# Altium project PWR_MNG.PRJPCB
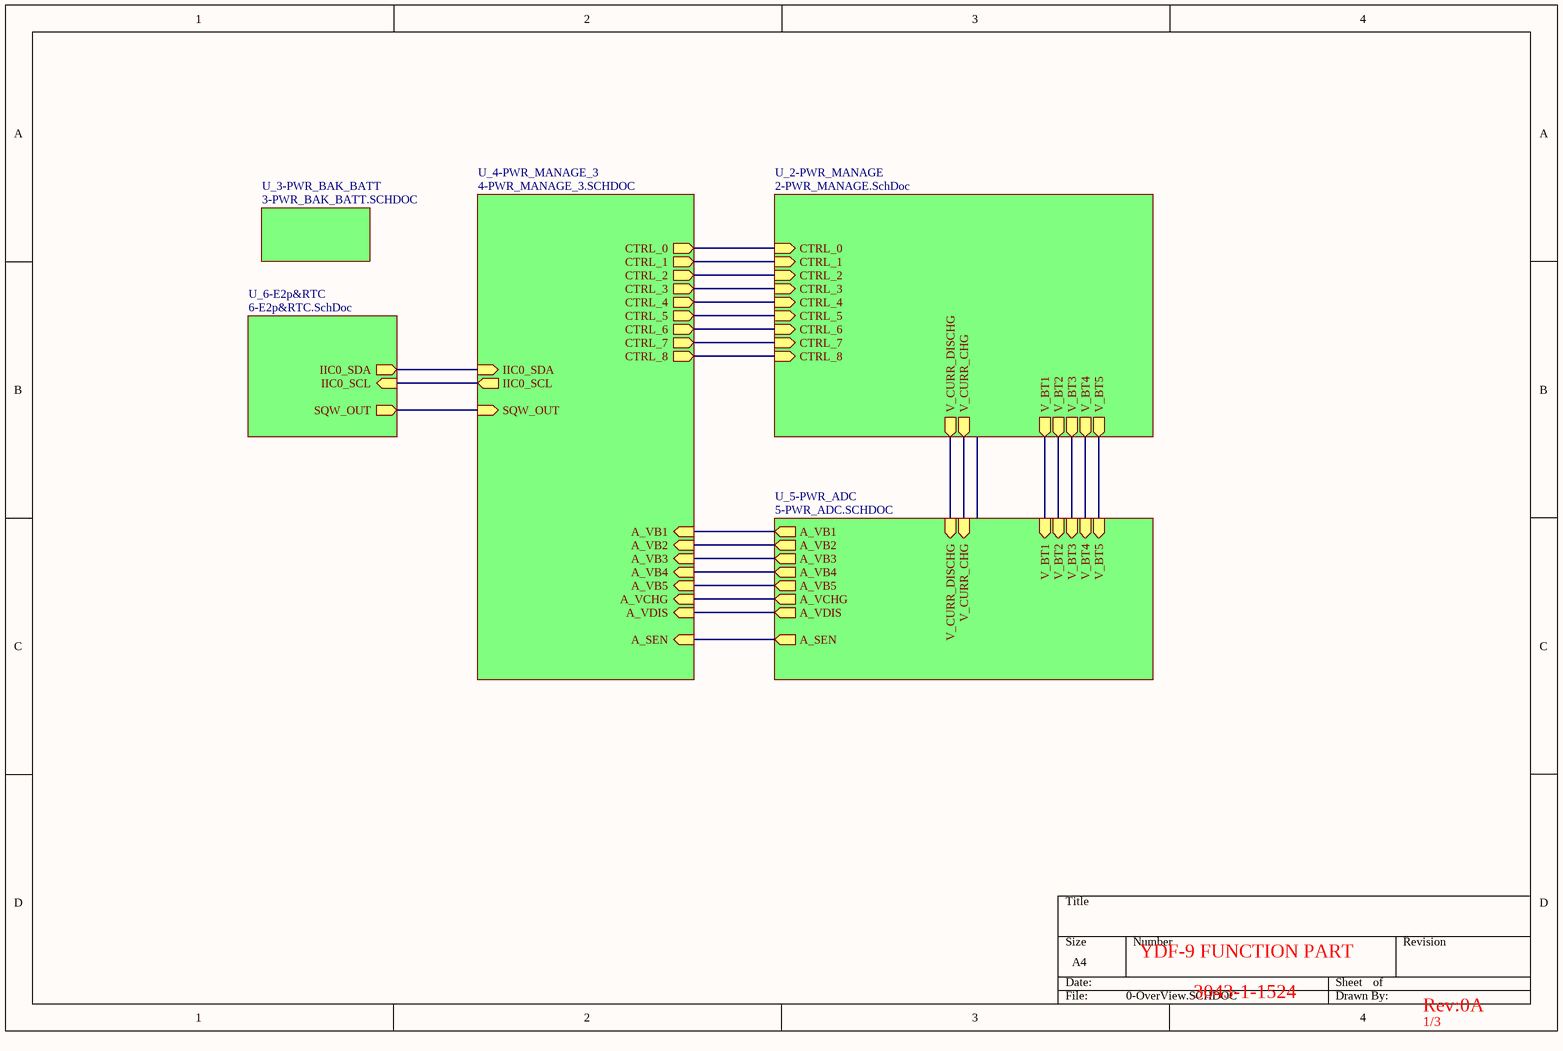
[diagram p0: 0-OverView.SCHDOC]
.TITLE: aaaaa
6 sheets, 178 parts. Net scope: hierarchical (ports join the sheet entries above them; power ports are global).
Board file: 3043-1-1532.PcbDoc
Sheets:
  0-OverView.SCHDOC
    U_2-PWR_MANAGE = 2-PWR_MANAGE.SchDoc
    U_3-PWR_BAK_BATT = 3-PWR_BAK_BATT.SCHDOC
    U_4-PWR_MANAGE_3 = 4-PWR_MANAGE_3.SCHDOC
    U_5-PWR_ADC = 5-PWR_ADC.SCHDOC
    U_6-E2p&RTC = 6-E2p&RTC.SchDoc

## Sheet 0-OverView.SCHDOC
size A4

### Sub-sheets
U_2-PWR_MANAGE = 2-PWR_MANAGE.SchDoc: V_BT1 (out), V_BT2 (out), V_BT3 (out), V_BT4 (out), V_BT5 (out), V_CURR_CHG (out), V_CURR_DISCHG (out), CTRL_8 (in), CTRL_0 (in), CTRL_2 (in), CTRL_7 (in), CTRL_1 (in), CTRL_4 (in), CTRL_3 (in), CTRL_5 (in), CTRL_6 (in)
U_3-PWR_BAK_BATT = 3-PWR_BAK_BATT.SCHDOC: no entries
U_4-PWR_MANAGE_3 = 4-PWR_MANAGE_3.SCHDOC: IIC0_SDA (in), IIC0_SCL (out), SQW_OUT (in), A_VDIS (in), A_VB5 (in), A_VCHG (in), A_VB1 (in), A_VB4 (in), A_VB2 (in), A_VB3 (in), CTRL_1 (out), CTRL_0 (out), CTRL_2 (out), CTRL_3 (out), CTRL_4 (out), CTRL_5 (out), CTRL_8 (out), CTRL_6 (out), CTRL_7 (out), A_SEN (in)
U_5-PWR_ADC = 5-PWR_ADC.SCHDOC: V_BT5 (in), V_BT3 (in), V_BT2 (in), V_BT4 (in), V_BT1 (in), A_VDIS (out), A_VB3 (out), A_VB5 (out), A_VB1 (out), A_VB4 (out), A_VCHG (out), A_VB2 (out), V_CURR_DISCHG (in), V_CURR_CHG (in), A_SEN (out)
U_6-E2p&RTC = 6-E2p&RTC.SchDoc: IIC0_SCL (in), IIC0_SDA (out), SQW_OUT (out)

### Nets
A_SEN: sheet U_4-PWR_MANAGE_3/A_SEN, sheet U_5-PWR_ADC/A_SEN
A_VB1: sheet U_4-PWR_MANAGE_3/A_VB1, sheet U_5-PWR_ADC/A_VB1
A_VB2: sheet U_4-PWR_MANAGE_3/A_VB2, sheet U_5-PWR_ADC/A_VB2
A_VB3: sheet U_4-PWR_MANAGE_3/A_VB3, sheet U_5-PWR_ADC/A_VB3
A_VB4: sheet U_4-PWR_MANAGE_3/A_VB4, sheet U_5-PWR_ADC/A_VB4
A_VB5: sheet U_4-PWR_MANAGE_3/A_VB5, sheet U_5-PWR_ADC/A_VB5
A_VCHG: sheet U_4-PWR_MANAGE_3/A_VCHG, sheet U_5-PWR_ADC/A_VCHG
A_VDIS: sheet U_4-PWR_MANAGE_3/A_VDIS, sheet U_5-PWR_ADC/A_VDIS
CTRL_0: sheet U_2-PWR_MANAGE/CTRL_0, sheet U_4-PWR_MANAGE_3/CTRL_0
CTRL_1: sheet U_2-PWR_MANAGE/CTRL_1, sheet U_4-PWR_MANAGE_3/CTRL_1
CTRL_2: sheet U_2-PWR_MANAGE/CTRL_2, sheet U_4-PWR_MANAGE_3/CTRL_2
CTRL_3: sheet U_2-PWR_MANAGE/CTRL_3, sheet U_4-PWR_MANAGE_3/CTRL_3
CTRL_4: sheet U_2-PWR_MANAGE/CTRL_4, sheet U_4-PWR_MANAGE_3/CTRL_4
CTRL_5: sheet U_2-PWR_MANAGE/CTRL_5, sheet U_4-PWR_MANAGE_3/CTRL_5
CTRL_6: sheet U_2-PWR_MANAGE/CTRL_6, sheet U_4-PWR_MANAGE_3/CTRL_6
CTRL_7: sheet U_2-PWR_MANAGE/CTRL_7, sheet U_4-PWR_MANAGE_3/CTRL_7
CTRL_8: sheet U_2-PWR_MANAGE/CTRL_8, sheet U_4-PWR_MANAGE_3/CTRL_8
IIC0_SCL: sheet U_4-PWR_MANAGE_3/IIC0_SCL, sheet U_6-E2p&RTC/IIC0_SCL
IIC0_SDA: sheet U_4-PWR_MANAGE_3/IIC0_SDA, sheet U_6-E2p&RTC/IIC0_SDA
SQW_OUT: sheet U_4-PWR_MANAGE_3/SQW_OUT, sheet U_6-E2p&RTC/SQW_OUT
V_BT1: sheet U_2-PWR_MANAGE/V_BT1, sheet U_5-PWR_ADC/V_BT1
V_BT2: sheet U_2-PWR_MANAGE/V_BT2, sheet U_5-PWR_ADC/V_BT2
V_BT3: sheet U_2-PWR_MANAGE/V_BT3, sheet U_5-PWR_ADC/V_BT3
V_BT4: sheet U_2-PWR_MANAGE/V_BT4, sheet U_5-PWR_ADC/V_BT4
V_BT5: sheet U_2-PWR_MANAGE/V_BT5, sheet U_5-PWR_ADC/V_BT5
V_CURR_CHG: sheet U_2-PWR_MANAGE/V_CURR_CHG, sheet U_5-PWR_ADC/V_CURR_CHG
V_CURR_DISCHG: sheet U_2-PWR_MANAGE/V_CURR_DISCHG, sheet U_5-PWR_ADC/V_CURR_DISCHG

### Notes on the sheet
- YDF-9 FUNCTION PART
- 3043-1-1524
- Rev:0A
- 1/3

## Sheet 2-PWR_MANAGE.SchDoc
size A4
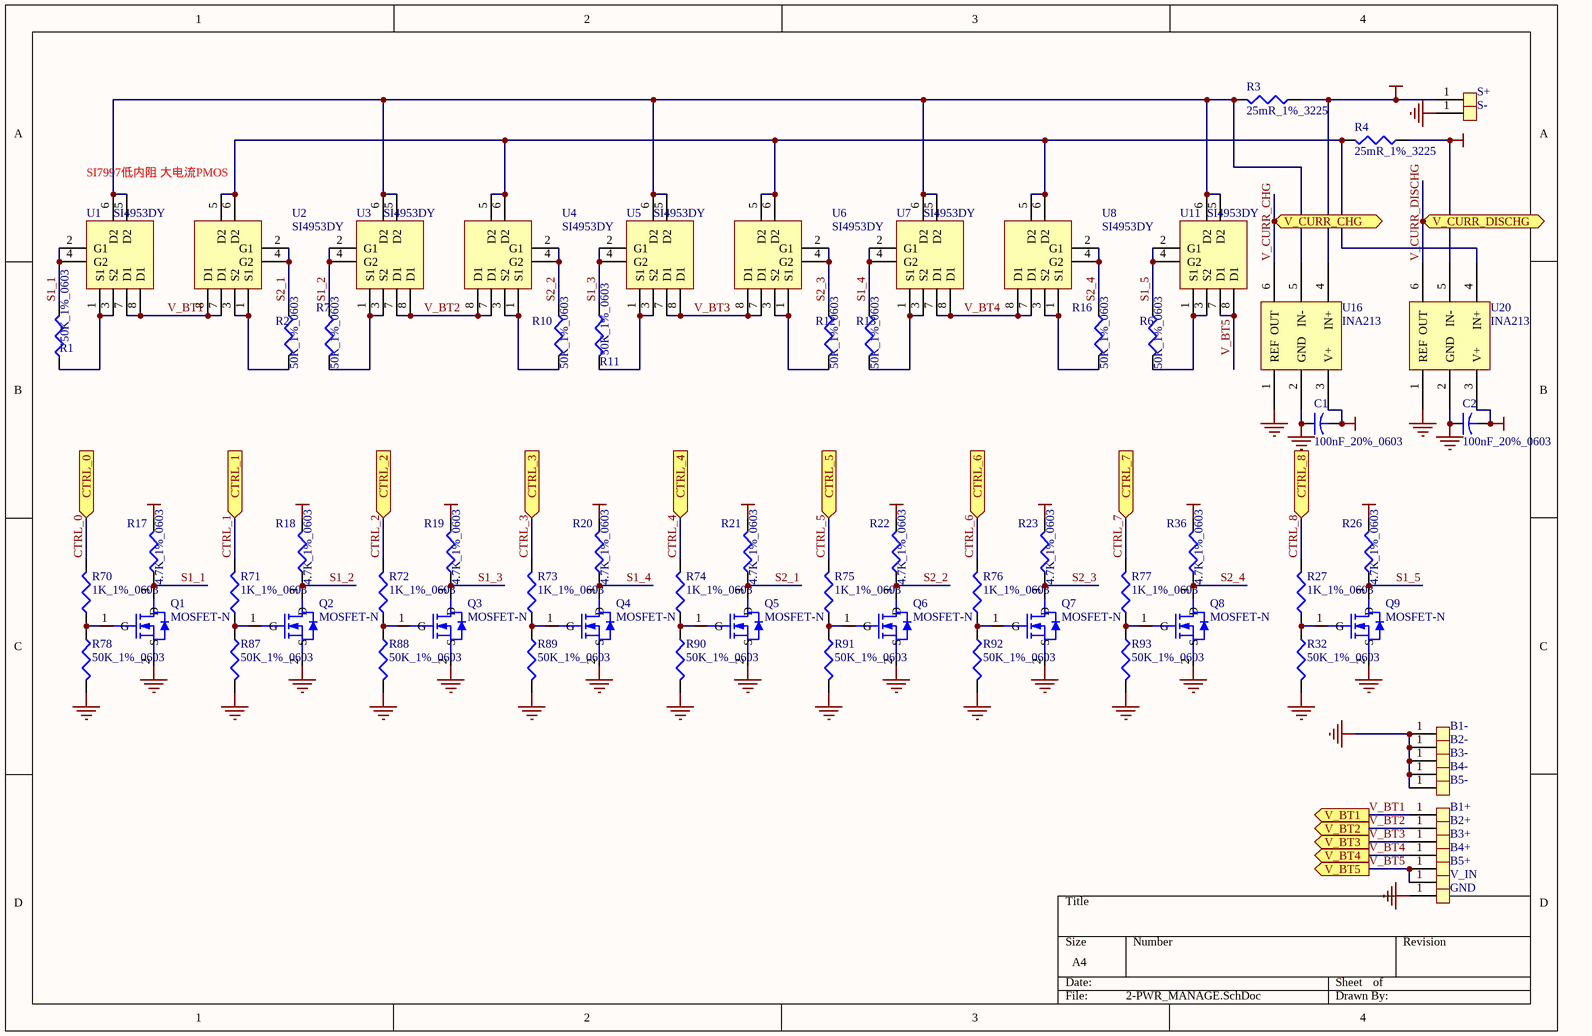
[diagram p1: 2-PWR_MANAGE.SchDoc]

### Parts
B1+  ND  [END_1.5_2.8]  (value not drawn)
B1-  ND  [END_1.5_2.8]  (value not drawn)
B2+  ND  [END_1.5_2.8]  (value not drawn)
B2-  ND  [END_1.5_2.8]  (value not drawn)
B3+  ND  [END_1.5_2.8]  (value not drawn)
B3-  ND  [END_1.5_2.8]  (value not drawn)
B4+  ND  [END_1.5_2.8]  (value not drawn)
B4-  ND  [END_1.5_2.8]  (value not drawn)
B5+  ND  [END_1.5_2.8]  (value not drawn)
B5-  ND  [END_1.5_2.8]  (value not drawn)
C1  100nF_20%_0603  [C1608-0603]
C2  100nF_20%_0603  [C1608-0603]
GND  ND  [END_3_6]  (value not drawn)
Q1  MOSFET-N  [SO-G3/C2.5]
Q2  MOSFET-N  [SO-G3/C2.5]
Q3  MOSFET-N  [SO-G3/C2.5]
Q4  MOSFET-N  [SO-G3/C2.5]
Q5  MOSFET-N  [SO-G3/C2.5]
Q6  MOSFET-N  [SO-G3/C2.5]
Q7  MOSFET-N  [SO-G3/C2.5]
Q8  MOSFET-N  [SO-G3/C2.5]
Q9  MOSFET-N  [SO-G3/C2.5]
R1  50K_1%_0603  [C1608-0603]
R2  50K_1%_0603  [C1608-0603]
R3  25mR_1%_3225  [CR6332-2512]
R4  25mR_1%_3225  [CR6332-2512]
R6  50K_1%_0603  [C1608-0603]
R7  50K_1%_0603  [C1608-0603]
R10  50K_1%_0603  [C1608-0603]
R11  50K_1%_0603  [C1608-0603]
R12  50K_1%_0603  [C1608-0603]
R13  50K_1%_0603  [C1608-0603]
R16  50K_1%_0603  [C1608-0603]
R17  4.7K_1%_0603  [C1608-0603]
R18  4.7K_1%_0603  [C1608-0603]
R19  4.7K_1%_0603  [C1608-0603]
R20  4.7K_1%_0603  [C1608-0603]
R21  4.7K_1%_0603  [C1608-0603]
R22  4.7K_1%_0603  [C1608-0603]
R23  4.7K_1%_0603  [C1608-0603]
R26  4.7K_1%_0603  [C1608-0603]
R27  1K_1%_0603  [C1608-0603]
R32  50K_1%_0603  [C1608-0603]
R36  4.7K_1%_0603  [C1608-0603]
R70  1K_1%_0603  [C1608-0603]
R71  1K_1%_0603  [C1608-0603]
R72  1K_1%_0603  [C1608-0603]
R73  1K_1%_0603  [C1608-0603]
R74  1K_1%_0603  [C1608-0603]
R75  1K_1%_0603  [C1608-0603]
R76  1K_1%_0603  [C1608-0603]
R77  1K_1%_0603  [C1608-0603]
R78  50K_1%_0603  [C1608-0603]
R87  50K_1%_0603  [C1608-0603]
R88  50K_1%_0603  [C1608-0603]
R89  50K_1%_0603  [C1608-0603]
R90  50K_1%_0603  [C1608-0603]
R91  50K_1%_0603  [C1608-0603]
R92  50K_1%_0603  [C1608-0603]
R93  50K_1%_0603  [C1608-0603]
S+  ND  [END_1.5_2.8]  (value not drawn)
S-  ND  [END_1.5_2.8]  (value not drawn)
U1  SI4953DY  [SO-8]
U2  SI4953DY  [SO-8]
U3  SI4953DY  [SO-8]
U4  SI4953DY  [SO-8]
U5  SI4953DY  [SO-8]
U6  SI4953DY  [SO-8]
U7  SI4953DY  [SO-8]
U8  SI4953DY  [SO-8]
U11  SI4953DY  [SO-8]
U16  INA213  [SC70-6]
U20  INA213  [SC70-6]
V_IN  ND  [END_3_6]  (value not drawn)

### Ports
CTRL_0 (in), CTRL_1 (in), CTRL_2 (in), CTRL_3 (in), CTRL_4 (in), CTRL_5 (in), CTRL_6 (in), CTRL_7 (in), CTRL_8 (in), V_BT1 (out), V_BT2 (out), V_BT3 (out), V_BT4 (out), V_BT5 (out), V_CURR_CHG (out), V_CURR_DISCHG (out)

### Nets
GND: B1-.1(SW) B2-.1(SW) B3-.1(SW) B4-.1(SW) B5-.1(SW) C1.1 C2.1 GND.1(SW) Q1.2(S) Q2.2(S) Q3.2(S) Q4.2(S) Q5.2(S) Q6.2(S) Q7.2(S) Q8.2(S) Q9.2(S) R32.2 R78.2 R87.2 R88.2 R89.2 R90.2 R91.2 R92.2 R93.2 S-.1(SW) U16.1(REF) U16.2(GND) U20.1(REF) U20.2(GND)
VCC_2V8: C1.2 C2.2 U16.3(V+) U20.3(V+)
VCC_5V: R17.2 R18.2 R19.2 R20.2 R21.2 R22.2 R23.2 R26.2 R36.2
VCC_BAT: R4.1 U20.5(IN-)
VCC_CHARGE: R3.1 S+.1(SW) U16.4(IN+)
CTRL_0: R70.2 ; port CTRL_0
CTRL_1: R71.2 ; port CTRL_1
CTRL_2: R72.2 ; port CTRL_2
CTRL_3: R73.2 ; port CTRL_3
CTRL_4: R74.2 ; port CTRL_4
CTRL_5: R75.2 ; port CTRL_5
CTRL_6: R76.2 ; port CTRL_6
CTRL_7: R77.2 ; port CTRL_7
CTRL_8: R27.2 ; port CTRL_8
S1_1: Q1.3(D) R1.2 R17.1 U1.2(G1) U1.4(G2)
S1_2: Q2.3(D) R7.1 R18.1 U3.2(G1) U3.4(G2)
S1_3: Q3.3(D) R11.1 R19.1 U5.2(G1) U5.4(G2)
S1_4: Q4.3(D) R13.1 R20.1 U7.2(G1) U7.4(G2)
S1_5: Q9.3(D) R6.1 R26.1 U11.2(G1) U11.4(G2)
S2_1: Q5.3(D) R2.1 R21.1 U2.2(G1) U2.4(G2)
S2_2: Q6.3(D) R10.1 R22.1 U4.2(G1) U4.4(G2)
S2_3: Q7.3(D) R12.1 R23.1 U6.2(G1) U6.4(G2)
S2_4: Q8.3(D) R16.1 R36.1 U8.2(G1) U8.4(G2)
V_BT1: B1+.1(SW) U1.7(D1) U1.8(D1) U2.7(D1) U2.8(D1) ; port V_BT1
V_BT2: B2+.1(SW) U3.7(D1) U3.8(D1) U4.7(D1) U4.8(D1) ; port V_BT2
V_BT3: B3+.1(SW) U5.7(D1) U5.8(D1) U6.7(D1) U6.8(D1) ; port V_BT3
V_BT4: B4+.1(SW) U7.7(D1) U7.8(D1) U8.7(D1) U8.8(D1) ; port V_BT4
V_BT5: B5+.1(SW) U11.7(D1) U11.8(D1) V_IN.1(SW) ; port V_BT5
V_CURR_CHG: U16.6(OUT) ; port V_CURR_CHG
V_CURR_DISCHG: U20.6(OUT) ; port V_CURR_DISCHG
NetQ1_1: Q1.1(G) R70.1 R78.1
NetQ2_1: Q2.1(G) R71.1 R87.1
NetQ3_1: Q3.1(G) R72.1 R88.1
NetQ4_1: Q4.1(G) R73.1 R89.1
NetQ5_1: Q5.1(G) R74.1 R90.1
NetQ6_1: Q6.1(G) R75.1 R91.1
NetQ7_1: Q7.1(G) R76.1 R92.1
NetQ8_1: Q8.1(G) R77.1 R93.1
NetQ9_1: Q9.1(G) R27.1 R32.1
NetR1_1: R1.1 U1.1(S1) U1.3(S2)
NetR2_2: R2.2 U2.1(S1) U2.3(S2)
NetR3_2: R3.2 U1.5(D2) U1.6(D2) U3.5(D2) U3.6(D2) U5.5(D2) U5.6(D2) U7.5(D2) U7.6(D2) U11.5(D2) U11.6(D2) U16.5(IN-)
NetR4_2: R4.2 U2.5(D2) U2.6(D2) U4.5(D2) U4.6(D2) U6.5(D2) U6.6(D2) U8.5(D2) U8.6(D2) U20.4(IN+)
NetR6_2: R6.2 U11.1(S1) U11.3(S2)
NetR7_2: R7.2 U3.1(S1) U3.3(S2)
NetR10_2: R10.2 U4.1(S1) U4.3(S2)
NetR11_2: R11.2 U5.1(S1) U5.3(S2)
NetR12_2: R12.2 U6.1(S1) U6.3(S2)
NetR13_2: R13.2 U7.1(S1) U7.3(S2)
NetR16_2: R16.2 U8.1(S1) U8.3(S2)

### Notes on the sheet
- SI7997低内阻 大电流PMOS

### Library data of the parts
C1 C2 = Cap2: Capacitor; Value: 0.1uF 20% 0603; Published: 23-Sep-2002; Publisher: Altium Limited
R1 R2 R6 R7 R10-R13 R16-R23 R26 R27 R32 R36 R70-R78 R87-R93 = Res3: Resistor; Value: 1K%5 0603; Published: 8-Jun-2000; Revision: July-2002: Re-released for DXP Platform.; Publisher: Altium Limited
R3 R4 = Res3: Resistor; Value: 150R %5 0603; Published: 8-Jun-2000; Revision: July-2002: Re-released for DXP Platform.; Publisher: Altium Limited

## Sheet 3-PWR_BAK_BATT.SCHDOC
size A4
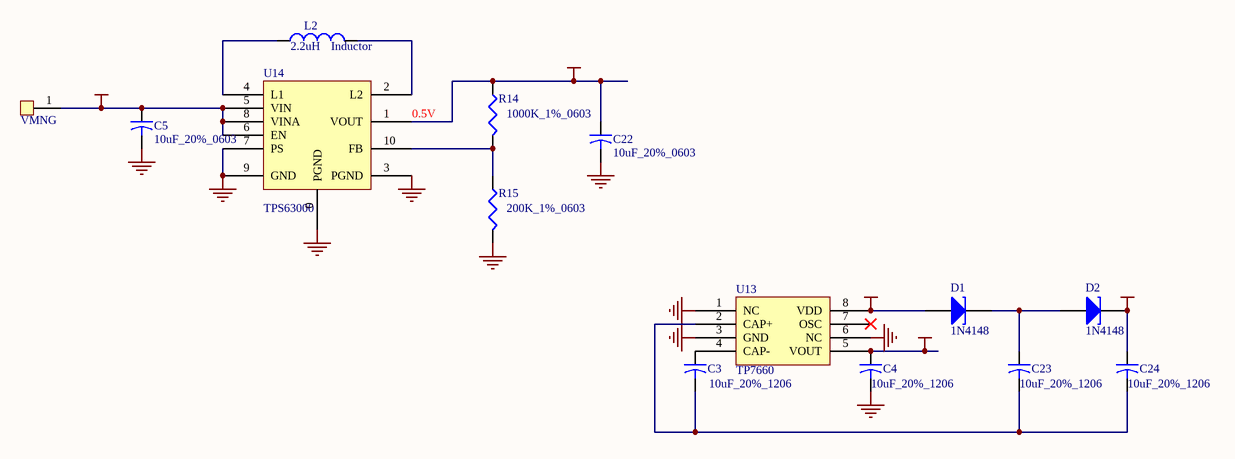
[diagram p2: 3-PWR_BAK_BATT.SCHDOC]

### Parts
C3  10uF_20%_1206  [CC3216-1206]
C4  10uF_20%_1206  [CC3216-1206]
C5  10uF_20%_0603  [C1608-0603]
C22  10uF_20%_0603  [C1608-0603]
C23  10uF_20%_1206  [CC3216-1206]
C24  10uF_20%_1206  [CC3216-1206]
D1  1N4148  [LED0805]
D2  1N4148  [LED0805]
L2  Inductor  value 2.2uH  [L3x3x1.5_5A]
R14  1000K_1%_0603  [C1608-0603]
R15  200K_1%_0603  [C1608-0603]
U13  TP7660  [SO-8]
U14  TPS63000  [QFN-10]
VMNG  ND  [END_3_6]  (value not drawn)

### Nets
GND: C4.2 C5.2 C22.2 R15.2 U13.1(NC) U13.3(GND) U13.6(NC) U14.0(PGND) U14.3(PGND) U14.7(PS) U14.9(GND)
VCC_2V8: C22.1 D1.1(A) R14.1 U13.8(VDD) U14.1(VOUT)
VCC_5V: C24.1 D2.2(K)
VCC_-2V8: C4.1 U13.5(VOUT)
VCC_MNG: C5.1 U14.5(VIN) U14.6(EN) U14.8(VINA) VMNG.1(SW)
NetC3_1: C3.1 U13.4(CAP-)
NetC3_2: C3.2 C23.2 C24.2 U13.2(CAP+)
NetC23_1: C23.1 D1.2(K) D2.1(A)
NetL2_1: L2.1 U14.4(L1)
NetL2_2: L2.2 U14.2(L2)
NetR14_2: R14.2 R15.1 U14.10(FB)

Not connected (* = marked no-connect by the designer): U13 7(OSC)*

### Notes on the sheet
- 0.5V

### Library data of the parts
C3 C4 C23 C24 = Cap2: Capacitor; Value: 10uF; Published: 23-Sep-2002; Publisher: Altium Limited
C5 C22 = Cap2: Capacitor; Value: 0.1uF 20% 0603; Published: 23-Sep-2002; Publisher: Altium Limited
D1 D2 = D Tunnel1: Tunnel Diode - RLC Model; Published: 8-Jun-2000; LatestRevisionDate: 17-Jul-2002; LatestRevisionNote: Re-released for DXP Platform.; Publisher: Altium Limited
R14 R15 = Res3: Resistor; Value: 1K%5 0603; Published: 8-Jun-2000; Revision: July-2002: Re-released for DXP Platform.; Publisher: Altium Limited
L2 = Inductor: Published: 8-Jun-2000; Revision: July-2002: Re-released for DXP Platform.; Publisher: Altium Limited

## Sheet 4-PWR_MANAGE_3.SCHDOC
size A4
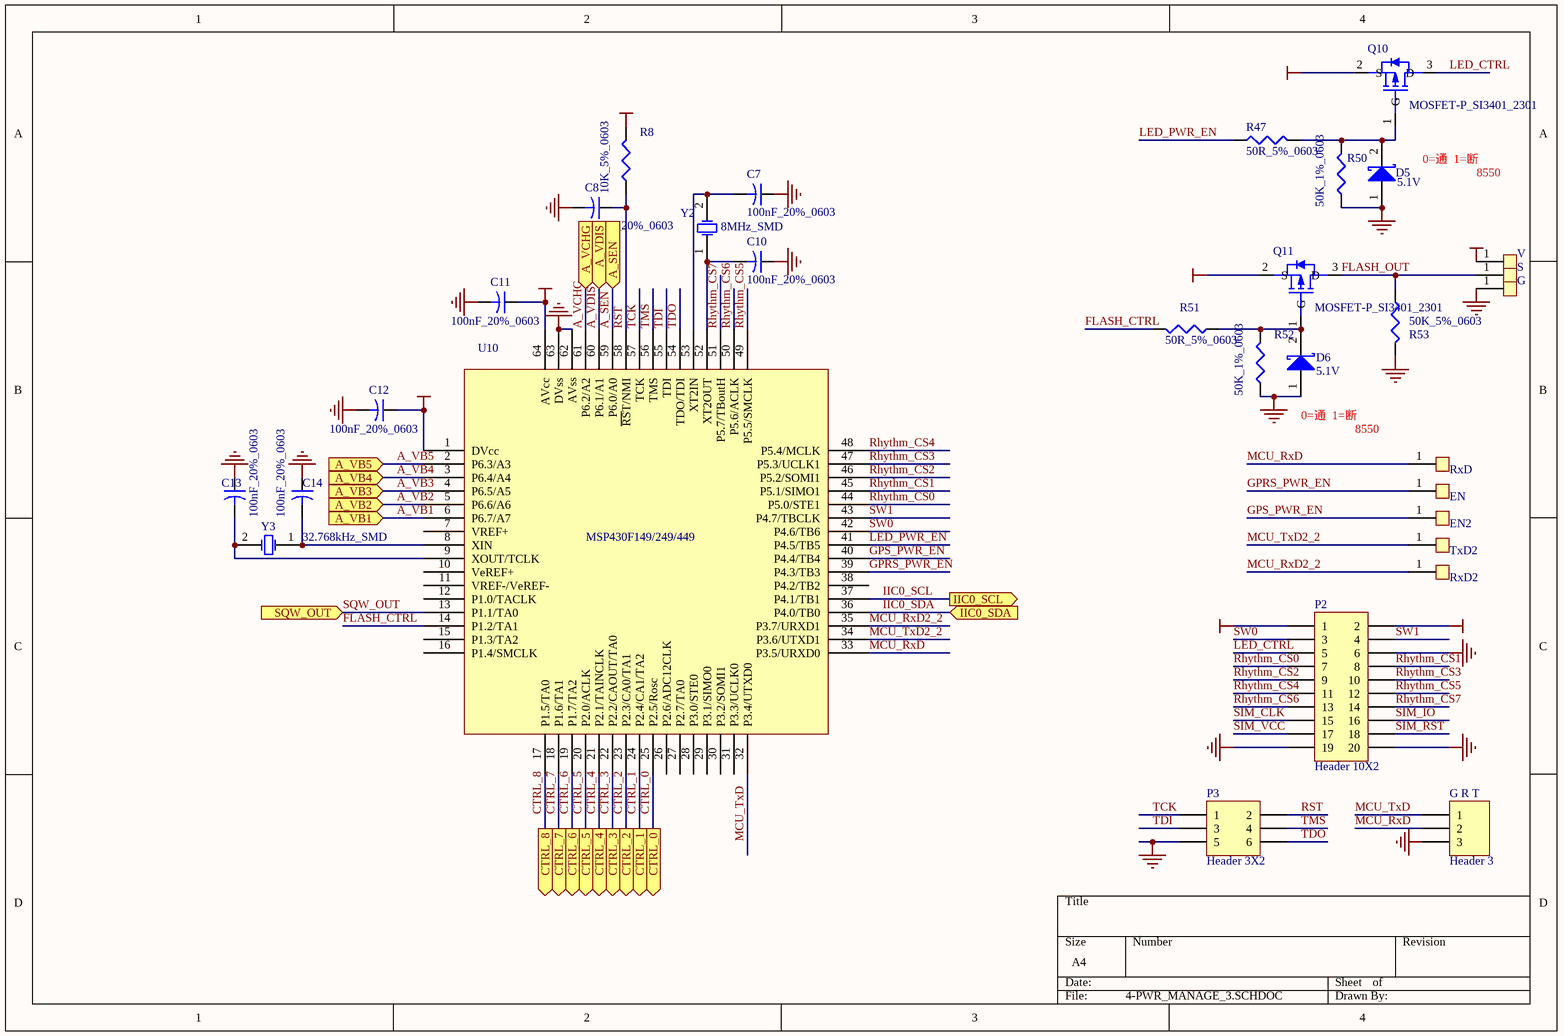
[diagram p3: 4-PWR_MANAGE_3.SCHDOC]

### Parts
C7  100nF_20%_0603  [C1608-0603]
C8  100nF_20%_0603  [C1608-0603]
C10  100nF_20%_0603  [C1608-0603]
C11  100nF_20%_0603  [C1608-0603]
C12  100nF_20%_0603  [C1608-0603]
C13  100nF_20%_0603  [C1608-0603]
C14  100nF_20%_0603  [C1608-0603]
D5  5.1V  [LED0805]
D6  5.1V  [LED0805]
EN  ND  [END_3_6]  (value not drawn)
EN2  ND  [END_3_6]  (value not drawn)
G  ND  [END_1.5_2.8]  (value not drawn)
G_R_T  Header 3  [XH-03H]
P2  Header 10X2  [HDR2X10]
P3  Header 3X2  [HDR2X3]
Q10  MOSFET-P_SI3401_2301  [SO-G3/C2.5]
Q11  MOSFET-P_SI3401_2301  [SO-G3/C2.5]
R8  10K_5%_0603  [C1608-0603]
R47  50R_5%_0603  [C1608-0603]
R50  50K_1%_0603  [C1608-0603]
R51  50R_5%_0603  [C1608-0603]
R52  50K_1%_0603  [C1608-0603]
R53  50K_5%_0603  [C1608-0603]
RxD  ND  [END_3_6]  (value not drawn)
RxD2  ND  [END_3_6]  (value not drawn)
S  ND  [END_1.5_2.8]  (value not drawn)
TxD2  ND  [END_3_6]  (value not drawn)
U10  MSP430F149/249/449  [QFP-64]
V  ND  [END_1.5_2.8]  (value not drawn)
Y2  8MHz_SMD  [XTAL-P4mm_SMD]
Y3  32.768kHz_SMD  [XTAL-3216]

### Ports
A_SEN (in), A_VB1 (in), A_VB2 (in), A_VB3 (in), A_VB4 (in), A_VB5 (in), A_VCHG (in), A_VDIS (in), CTRL_0 (out), CTRL_1 (out), CTRL_2 (out), CTRL_3 (out), CTRL_4 (out), CTRL_5 (out), CTRL_6 (out), CTRL_7 (out), CTRL_8 (out), IIC0_SCL (out), IIC0_SDA (in), SQW_OUT (in)

### Nets
GND: C7.1 C8.2 C10.1 C11.2 C12.2 C13.1 C14.1 D5.1(A) D6.1(A) G.1(SW) G_R_T.3 P2.6 P2.19 P2.20 P3.5 R50.1 R52.1 R53.2 U10.62(AVss) U10.63(DVss)
VCC_2V8: C11.1 C12.1 P2.1 P2.2 Q10.2(S) Q11.2(S) R8.2 U10.1(DVcc) U10.64(AVcc)
VCC_BAT: V.1(SW)
A_SEN: U10.59(P6.0/A0) ; port A_SEN
A_VB1: U10.6(P6.7/A7) ; port A_VB1
A_VB2: U10.5(P6.6/A6) ; port A_VB2
A_VB3: U10.4(P6.5/A5) ; port A_VB3
A_VB4: U10.3(P6.4/A4) ; port A_VB4
A_VB5: U10.2(P6.3/A3) ; port A_VB5
A_VCHG: U10.61(P6.2/A2) ; port A_VCHG
A_VDIS: U10.60(P6.1/A1) ; port A_VDIS
CTRL_0: U10.25(P2.5/Rosc) ; port CTRL_0
CTRL_1: U10.24(P2.4/CA1/TA2) ; port CTRL_1
CTRL_2: U10.23(P2.3/CA0/TA1) ; port CTRL_2
CTRL_3: U10.22(P2.2/CAOUT/TA0) ; port CTRL_3
CTRL_4: U10.21(P2.1/TAINCLK) ; port CTRL_4
CTRL_5: U10.20(P2.0/ACLK) ; port CTRL_5
CTRL_6: U10.19(P1.7/TA2) ; port CTRL_6
CTRL_7: U10.18(P1.6/TA1) ; port CTRL_7
CTRL_8: U10.17(P1.5/TA0) ; port CTRL_8
FLASH_CTRL: R51.2 U10.14(P1.2/TA1)
FLASH_OUT: Q11.3(D) R53.1 S.1(SW)
GPRS_PWR_EN: EN.1(SW) U10.39(P4.3/TB3)
GPS_PWR_EN: EN2.1(SW) U10.40(P4.4/TB4)
IIC0_SCL: U10.37(P4.1/TB1) ; port IIC0_SCL
IIC0_SDA: U10.36(P4.0/TB0) ; port IIC0_SDA
LED_CTRL: P2.5 Q10.3(D)
LED_PWR_EN: R47.1 U10.41(P4.5/TB5)
MCU_RxD: G_R_T.2 RxD.1(SW) U10.33(P3.5/URXD0)
MCU_RxD2_2: RxD2.1(SW) U10.35(P3.7/URXD1)
MCU_TxD: G_R_T.1 U10.32(P3.4/UTXD0)
MCU_TxD2_2: TxD2.1(SW) U10.34(P3.6/UTXD1)
Rhythm_CS0: P2.7 U10.44(P5.0/STE1)
Rhythm_CS1: P2.8 U10.45(P5.1/SIMO1)
Rhythm_CS2: P2.9 U10.46(P5.2/SOMI1)
Rhythm_CS3: P2.10 U10.47(P5.3/UCLK1)
Rhythm_CS4: P2.11 U10.48(P5.4/MCLK)
Rhythm_CS5: P2.12 U10.49(P5.5/SMCLK)
Rhythm_CS6: P2.13 U10.50(P5.6/ACLK)
Rhythm_CS7: P2.14 U10.51(P5.7/TBoutH)
RST: C8.1 P3.2 R8.1 U10.58(~{RS}T/NMI)
SIM_CLK: P2.15
SIM_IO: P2.16
SIM_RST: P2.18
SIM_VCC: P2.17
SQW_OUT: U10.13(P1.1/TA0) ; port SQW_OUT
SW0: P2.3 U10.42(P4.6/TB6)
SW1: P2.4 U10.43(P4.7/TBCLK)
TCK: P3.1 U10.57(TCK)
TDI: P3.3 U10.55(TDI)
TDO: P3.6 U10.54(TDO/TDI)
TMS: P3.4 U10.56(TMS)
NetC7_2: C7.2 U10.53(XT2IN) Y2.2(OSC2)
NetC10_2: C10.2 U10.52(XT2OUT) Y2.1(OSC1)
NetC13_2: C13.2 U10.9(XOUT/TCLK) Y3.2(OSC2)
NetC14_2: C14.2 U10.8(XIN) Y3.1(OSC1)
NetD5_2: D5.2(K) Q10.1(G) R47.2 R50.2
NetD6_2: D6.2(K) Q11.1(G) R51.1 R52.2

Not connected (* = marked no-connect by the designer): U10 7(VREF+) 10(VeREF+) 11(VREF-/VeREF-) 12(P1.0/TACLK) 15(P1.3/TA2) 16(P1.4/SMCLK) 26(P2.6/ADC12CLK) 27(P2.7/TA0) 28(P3.0/STE0) 29(P3.1/SIMO0) 30(P3.2/SOMI1) 31(P3.3/UCLK0) 38(P4.2/TB2)

### Notes on the sheet
- 0=通  1=断
- 8550

### Library data of the parts
C7 C8 C10-C14 = Cap2: Capacitor; Value: 0.1uF 20% 0603; Published: 23-Sep-2002; Publisher: Altium Limited
D5 D6 = D Schottky: Schottky Diode; Code - JEDEC: DO-214-AA; Published: 8-Jun-2000; Revision: July-2002: Re-released for DXP Platform.; Publisher: Altium Limited
G_R_T = Header 3: Header, 3-Pin; LatestRevisionDate: 17-Jul-2002; LatestRevisionNote: Re-released for DXP Platform.; Publisher: Altium Limited
P2 = Header 10X2: Header, 10-Pin, Dual row; LatestRevisionDate: 17-Jul-2002; LatestRevisionNote: Re-released for DXP Platform.; Publisher: Altium Limited
P3 = Header 3X2: Header, 3-Pin, Dual row; LatestRevisionDate: 17-Jul-2002; LatestRevisionNote: Re-released for DXP Platform.; Publisher: Altium Limited
Q10 Q11 = MOSFET-P
R8 R47 R50-R53 = Res3: Resistor; Value: 1K%5 0603; Published: 8-Jun-2000; Revision: July-2002: Re-released for DXP Platform.; Publisher: Altium Limited
Y2 Y3 = XTAL: Crystal Oscillator; Published: 8-Jun-2000; Revision: July-2002: Re-released for DXP Platform.; Publisher: Altium Limited

## Sheet 5-PWR_ADC.SCHDOC
size A4
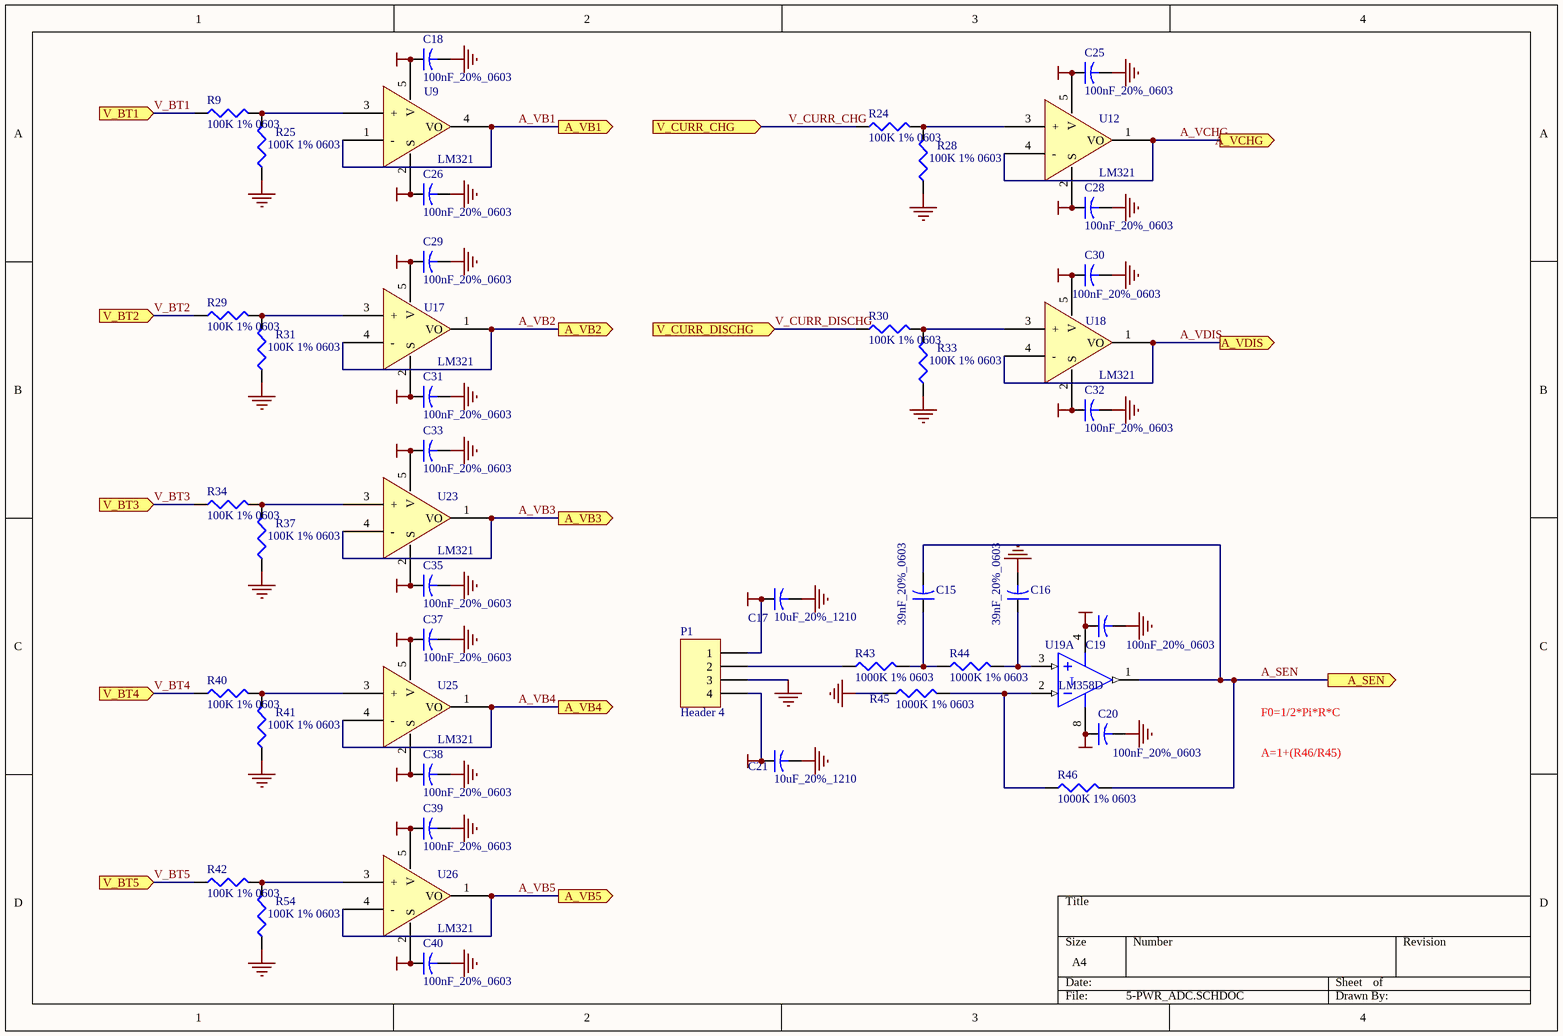
[diagram p4: 5-PWR_ADC.SCHDOC]

### Parts
C15  39nF_20%_0603  [C1608-0603]
C16  39nF_20%_0603  [C1608-0603]
C17  10uF_20%_1210  [CC3216-1206]
C18  100nF_20%_0603  [C1608-0603]
C19  100nF_20%_0603  [C1608-0603]
C20  100nF_20%_0603  [C1608-0603]
C21  10uF_20%_1210  [CC3216-1206]
C25  100nF_20%_0603  [C1608-0603]
C26  100nF_20%_0603  [C1608-0603]
C28  100nF_20%_0603  [C1608-0603]
C29  100nF_20%_0603  [C1608-0603]
C30  100nF_20%_0603  [C1608-0603]
C31  100nF_20%_0603  [C1608-0603]
C32  100nF_20%_0603  [C1608-0603]
C33  100nF_20%_0603  [C1608-0603]
C35  100nF_20%_0603  [C1608-0603]
C37  100nF_20%_0603  [C1608-0603]
C38  100nF_20%_0603  [C1608-0603]
C39  100nF_20%_0603  [C1608-0603]
C40  100nF_20%_0603  [C1608-0603]
P1  Header 4  [XH-04H]
R9  value 100K 1% 0603  [C1608-0603]  (hidden comment: 1K_5%_0603)
R24  value 100K 1% 0603  [C1608-0603]  (hidden comment: 1K_5%_0603)
R25  value 100K 1% 0603  [C1608-0603]  (hidden comment: 1K_5%_0603)
R28  value 100K 1% 0603  [C1608-0603]  (hidden comment: 1K_5%_0603)
R29  value 100K 1% 0603  [C1608-0603]  (hidden comment: 1K_5%_0603)
R30  value 100K 1% 0603  [C1608-0603]  (hidden comment: 1K_5%_0603)
R31  value 100K 1% 0603  [C1608-0603]  (hidden comment: 1K_5%_0603)
R33  value 100K 1% 0603  [C1608-0603]  (hidden comment: 1K_5%_0603)
R34  value 100K 1% 0603  [C1608-0603]  (hidden comment: 1K_5%_0603)
R37  value 100K 1% 0603  [C1608-0603]  (hidden comment: 1K_5%_0603)
R40  value 100K 1% 0603  [C1608-0603]  (hidden comment: 1K_5%_0603)
R41  value 100K 1% 0603  [C1608-0603]  (hidden comment: 1K_5%_0603)
R42  value 100K 1% 0603  [C1608-0603]  (hidden comment: 1K_5%_0603)
R43  value 1000K 1% 0603  [C1608-0603]  (hidden comment: 1K_5%_0603)
R44  value 1000K 1% 0603  [C1608-0603]  (hidden comment: 1K_5%_0603)
R45  value 1000K 1% 0603  [C1608-0603]  (hidden comment: 1K_5%_0603)
R46  value 1000K 1% 0603  [C1608-0603]  (hidden comment: 1K_5%_0603)
R54  value 100K 1% 0603  [C1608-0603]  (hidden comment: 1K_5%_0603)
U9  LM321  [SOT23-5]
U12  LM321  [SOT23-5]
U17  LM321  [SOT23-5]
U18  LM321  [SOT23-5]
U19  LM358D  [751-02]  (part A of 2)
U23  LM321  [SOT23-5]
U25  LM321  [SOT23-5]
U26  LM321  [SOT23-5]

### Ports
A_SEN (out), A_VB1 (out), A_VB2 (out), A_VB3 (out), A_VB4 (out), A_VB5 (out), A_VCHG (out), A_VDIS (out), V_BT1 (in), V_BT2 (in), V_BT3 (in), V_BT4 (in), V_BT5 (in), V_CURR_CHG (in), V_CURR_DISCHG (in)

### Nets
GND: C16.2 C17.2 C18.2 C19.2 C20.2 C21.2 C25.2 C26.2 C28.2 C29.2 C30.2 C31.2 C32.2 C33.2 C35.2 C37.2 C38.2 C39.2 C40.2 P1.3 R25.1 R28.1 R31.1 R33.1 R37.1 R41.1 R45.1 R54.1
VCC_2V8: C17.1 C18.1 C20.1 C25.1 C29.1 C30.1 C33.1 C37.1 C39.1 P1.1 U9.5(V) U12.5(V) U17.5(V) U18.5(V) U19.8(V+) U23.5(V) U25.5(V) U26.5(V)
VCC_-2V8: C19.1 C21.1 C26.1 C28.1 C31.1 C32.1 C35.1 C38.1 C40.1 P1.4 U9.2(S) U12.2(S) U17.2(S) U18.2(S) U19.4(V-) U23.2(S) U25.2(S) U26.2(S)
A_SEN: C15.2 R46.2 U19.1(OUT) ; port A_SEN
A_VB1: U9.1(-) U9.4(VO) ; port A_VB1
A_VB2: U17.1(VO) U17.4(-) ; port A_VB2
A_VB3: U23.1(VO) U23.4(-) ; port A_VB3
A_VB4: U25.1(VO) U25.4(-) ; port A_VB4
A_VB5: U26.1(VO) U26.4(-) ; port A_VB5
A_VCHG: U12.1(VO) U12.4(-) ; port A_VCHG
A_VDIS: U18.1(VO) U18.4(-) ; port A_VDIS
V_BT1: R9.1 ; port V_BT1
V_BT2: R29.1 ; port V_BT2
V_BT3: R34.1 ; port V_BT3
V_BT4: R40.1 ; port V_BT4
V_BT5: R42.1 ; port V_BT5
V_CURR_CHG: R24.1 ; port V_CURR_CHG
V_CURR_DISCHG: R30.1 ; port V_CURR_DISCHG
NetC15_1: C15.1 R43.2 R44.1
NetC16_1: C16.1 R44.2 U19.3(IN+)
NetP1_2: P1.2 R43.1
NetR9_2: R9.2 R25.2 U9.3(+)
NetR24_2: R24.2 R28.2 U12.3(+)
NetR29_2: R29.2 R31.2 U17.3(+)
NetR30_2: R30.2 R33.2 U18.3(+)
NetR34_2: R34.2 R37.2 U23.3(+)
NetR40_2: R40.2 R41.2 U25.3(+)
NetR42_2: R42.2 R54.2 U26.3(+)
NetR45_2: R45.2 R46.1 U19.2(IN-)

### Notes on the sheet
- F0=1/2*Pi*R*C
- A=1+(R46/R45)

### Library data of the parts
C15-C21 C25 C26 C28-C33 C35 C37-C40 = Cap2: Capacitor; Value: 0.1uF 20% 0603; Published: 23-Sep-2002; Publisher: Altium Limited
P1 = Header 4: Header, 4-Pin; LatestRevisionDate: 17-Jul-2002; LatestRevisionNote: Re-released for DXP Platform.; Publisher: Altium Limited
R9 R24 R25 R28-R31 R33 R34 R37 R40-R46 R54 = Res3: Resistor; Published: 8-Jun-2000; Revision: July-2002: Re-released for DXP Platform.; Publisher: Altium Limited
U9 U12 U17 U18 U23 U25 U26 = MCP6141
U19 = LM358D: Dual Low-Power Operational Amplifier; Published: 17-Jul-2002; DatasheetDocument: 1988; PackageReference: 751-02; Publisher: Altium Limited; Code_JEDEC: MS-012-AA; Code_IPC: SO8

## Sheet 6-E2p&RTC.SchDoc
size A4
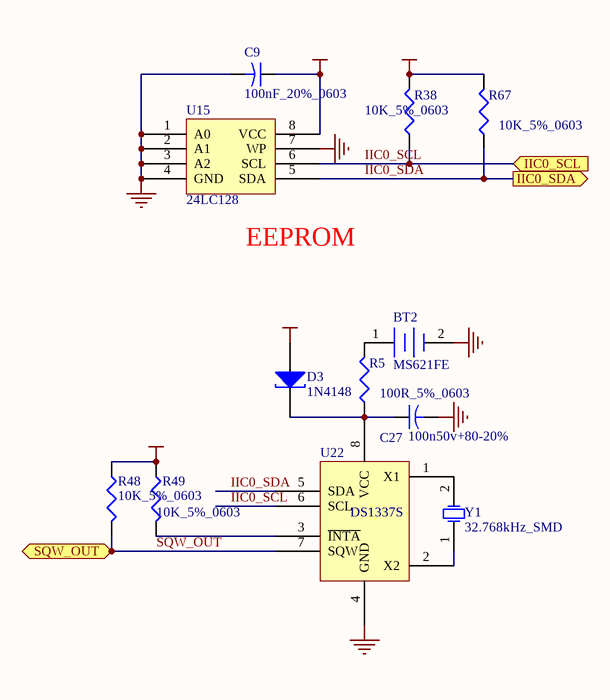
[diagram p5: 6-E2p&RTC.SchDoc]

### Parts
BT2  MS621FE  [BATT_BAK]
C9  100nF_20%_0603  [C1608-0603]
C27  value 100n50v+80-20%  [C1608-0603]  (hidden comment: Cap2)
D3  1N4148  [LED0805]
R5  100R_5%_0603  [C1608-0603]
R38  10K_5%_0603  [C1608-0603]
R48  10K_5%_0603  [C1608-0603]
R49  10K_5%_0603  [C1608-0603]
R67  10K_5%_0603  [C1608-0603]
U15  24LC128  [8s1]
U22  DS1337S  [SO-8]
Y1  32.768kHz_SMD  [XTAL-3216]

### Ports
IIC0_SCL (in), IIC0_SDA (out), SQW_OUT (out)

### Nets
GND: BT2.2(-) C9.2 C27.2 U15.1(A0) U15.2(A1) U15.3(A2) U15.4(GND) U15.7(WP) U22.4(GND)
VCC_2V8: C9.1 D3.1(A) R38.2 R48.1 R49.1 R67.2 U15.8(VCC)
IIC0_SCL: R38.1 U15.6(SCL) U22.6(SCL) ; port IIC0_SCL
IIC0_SDA: R67.1 U15.5(SDA) U22.5(SDA) ; port IIC0_SDA
SQW_OUT: R48.2 U22.7(SQW) ; port SQW_OUT
NetBT2_1: BT2.1(+) R5.2
NetC27_1: C27.1 D3.2(K) R5.1 U22.8(VCC)
NetR49_2: R49.2 U22.3(~{INTA})
NetU22_1: U22.1(X1) Y1.2(OSC2)
NetU22_2: U22.2(X2) Y1.1(OSC1)

### Notes on the sheet
- (near U15) EEPROM

### Library data of the parts
BT2 = Battery: Multicell Battery; Published: 24-Mar-1999; Revision: July-2002: Re-released for DXP Platform.; Publisher: Altium Limited
C9 = Cap2: Capacitor; Value: 0.1uF 0603; Published: 23-Sep-2002; Publisher: Altium Limited
C27 = Cap2: Capacitor; Published: 23-Sep-2002; Publisher: Altium Limited
D3 = D Tunnel1: Tunnel Diode - RLC Model; Published: 8-Jun-2000; LatestRevisionDate: 17-Jul-2002; LatestRevisionNote: Re-released for DXP Platform.; Publisher: Altium Limited
R5 R38 R48 R49 R67 = Res3: Resistor; Value: 1K%5 0603; Published: 8-Jun-2000; Revision: July-2002: Re-released for DXP Platform.; Publisher: Altium Limited
U15 = 24LC02: IC
Y1 = XTAL: Crystal Oscillator; Published: 8-Jun-2000; Revision: July-2002: Re-released for DXP Platform.; Publisher: Altium Limited

## Nets that join several sheets
GND: 2-PWR_MANAGE (31 pins), 3-PWR_BAK_BATT (11 pins), 4-PWR_MANAGE_3 (20 pins), 5-PWR_ADC (28 pins), 6-E2p&RTC (9 pins)
VCC_2V8: 2-PWR_MANAGE (C1.2 C2.2 U16.3 U20.3), 3-PWR_BAK_BATT (5 pins), 4-PWR_MANAGE_3 (9 pins), 5-PWR_ADC (18 pins), 6-E2p&RTC (7 pins)
VCC_5V: 2-PWR_MANAGE (9 pins), 3-PWR_BAK_BATT (C24.1 D2.2)
VCC_-2V8: 3-PWR_BAK_BATT (C4.1 U13.5), 5-PWR_ADC (18 pins)
VCC_BAT: 2-PWR_MANAGE (R4.1 U20.5), 4-PWR_MANAGE_3 (V.1)
A_SEN: 4-PWR_MANAGE_3 (U10.59), 5-PWR_ADC (C15.2 R46.2 U19.1)
A_VB1: 4-PWR_MANAGE_3 (U10.6), 5-PWR_ADC (U9.1 U9.4)
A_VB2: 4-PWR_MANAGE_3 (U10.5), 5-PWR_ADC (U17.1 U17.4)
A_VB3: 4-PWR_MANAGE_3 (U10.4), 5-PWR_ADC (U23.1 U23.4)
A_VB4: 4-PWR_MANAGE_3 (U10.3), 5-PWR_ADC (U25.1 U25.4)
A_VB5: 4-PWR_MANAGE_3 (U10.2), 5-PWR_ADC (U26.1 U26.4)
A_VCHG: 4-PWR_MANAGE_3 (U10.61), 5-PWR_ADC (U12.1 U12.4)
A_VDIS: 4-PWR_MANAGE_3 (U10.60), 5-PWR_ADC (U18.1 U18.4)
CTRL_0: 2-PWR_MANAGE (R70.2), 4-PWR_MANAGE_3 (U10.25)
CTRL_1: 2-PWR_MANAGE (R71.2), 4-PWR_MANAGE_3 (U10.24)
CTRL_2: 2-PWR_MANAGE (R72.2), 4-PWR_MANAGE_3 (U10.23)
CTRL_3: 2-PWR_MANAGE (R73.2), 4-PWR_MANAGE_3 (U10.22)
CTRL_4: 2-PWR_MANAGE (R74.2), 4-PWR_MANAGE_3 (U10.21)
CTRL_5: 2-PWR_MANAGE (R75.2), 4-PWR_MANAGE_3 (U10.20)
CTRL_6: 2-PWR_MANAGE (R76.2), 4-PWR_MANAGE_3 (U10.19)
CTRL_7: 2-PWR_MANAGE (R77.2), 4-PWR_MANAGE_3 (U10.18)
CTRL_8: 2-PWR_MANAGE (R27.2), 4-PWR_MANAGE_3 (U10.17)
IIC0_SCL: 4-PWR_MANAGE_3 (U10.37), 6-E2p&RTC (R38.1 U15.6 U22.6)
IIC0_SDA: 4-PWR_MANAGE_3 (U10.36), 6-E2p&RTC (R67.1 U15.5 U22.5)
SQW_OUT: 4-PWR_MANAGE_3 (U10.13), 6-E2p&RTC (R48.2 U22.7)
V_BT1: 2-PWR_MANAGE (5 pins), 5-PWR_ADC (R9.1)
V_BT2: 2-PWR_MANAGE (5 pins), 5-PWR_ADC (R29.1)
V_BT3: 2-PWR_MANAGE (5 pins), 5-PWR_ADC (R34.1)
V_BT4: 2-PWR_MANAGE (5 pins), 5-PWR_ADC (R40.1)
V_BT5: 2-PWR_MANAGE (B5+.1 U11.7 U11.8 V_IN.1), 5-PWR_ADC (R42.1)
V_CURR_CHG: 2-PWR_MANAGE (U16.6), 5-PWR_ADC (R24.1)
V_CURR_DISCHG: 2-PWR_MANAGE (U20.6), 5-PWR_ADC (R30.1)